# EAGLE design tinybot (EAGLE 7.0.0)
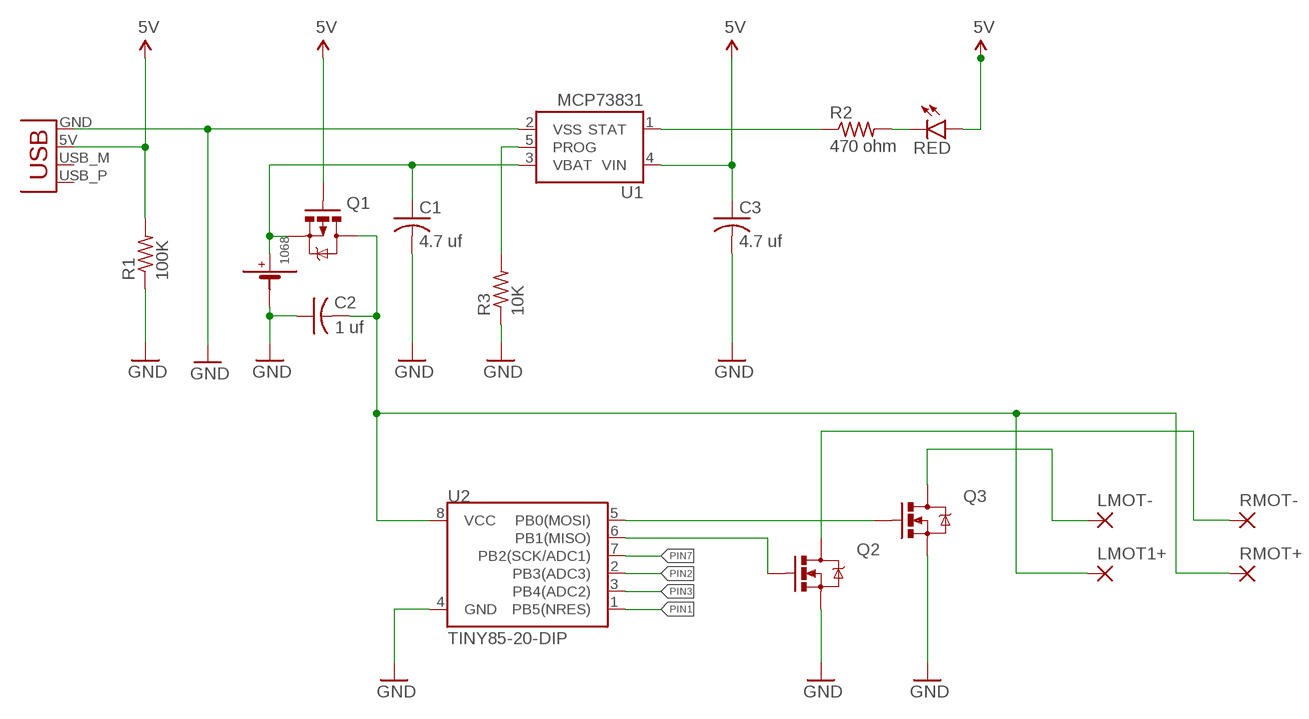
[diagram p0: schematic, sheet 1]

## Parts
C1  4.7 uf  C-US025-025X050  [C025-025X050]
C2  1 uf  C-US025-025X050  [C025-025X050]
C3  4.7 uf  C-US025-025X050  [C025-025X050]
JP1  USBPCB  [USB-A-PCB]
LMOT1+  WIREPADSMD1,27-254  [SMD1,27-2,54]
LMOT-  WIREPADSMD1,27-254  [SMD1,27-2,54]
Q1  MOSFET-PCHANNEL  [SOT23-3]
Q2  2N7002PW  MOSFET-NCHANNELBSS138  [SOT23]
Q3  2N7002PW  MOSFET-NCHANNELBSS138  [SOT23]
R1  100K  R-US_0204/5  [0204/5]
R2  470 ohm  R-US_0204/5  [0204/5]
R3  10K  R-US_0204/5  [0204/5]
RED  LED3MM  [LED3MM]
RMOT+  WIREPADSMD1,27-254  [SMD1,27-2,54]
RMOT-  WIREPADSMD1,27-254  [SMD1,27-2,54]
U1  MCP73831  [SOT23-5]
U2  TINY85-20-DIP  ATTINY45TINY85-20-DIP  [DIP08]
U$1  1068  [KEYSTONE1068]

## Nets
5V: C3.1 JP1.5V(VBUS) Q1.1(G) R1.2 RED.A U1.4(VIN)
GND: C1.2 C2.1 C3.2 JP1.GND Q2.2(S) Q3.2(S) R1.1 R3.1 U1.2(VSS) U2.4(GND) U$1.NEG(-)
N$1: R2.2 RED.K(C)
N$3: R2.1 U1.1(STAT)
N$4: Q3.1(G) U2.5(PB0(MOSI))
N$5: Q2.1(G) U2.6(PB1(MISO))
N$6: LMOT-.1(P) Q3.3(D)
N$8: Q2.3(D) RMOT-.1(P)
N$15: R3.2 U1.5(PROG)
PIN1: U2.1(PB5(NRES))
PIN2: U2.2(PB3(ADC3))
PIN3: U2.3(PB4(ADC2))
PIN7: U2.7(PB2(SCK/ADC1))
VBAT: C1.1 Q1.2(S) U1.3(VBAT) U$1.POS(+)
VCC: C2.2 LMOT1+.1(P) Q1.3(D) RMOT+.1(P) U2.8(VCC)
Unconnected: JP1.USB_M(D-) JP1.USB_P(D+)

## Library data of the parts
C1-C3 = rcl:C-US: CAPACITOR, American symbol
JP1 = SparkFun-Connectors:USB: USB Connectors USB-B-PTH is fully proven SKU : PRT-00139/CONN-08278 USB-miniB is fully proven SKU : PRT-00587 USB-A-PCB is untested. USB-A-H is throughly reviewed, but untested. Spark Fun Electronics SKU : PRT-00437 USB-B-SMT is throughly reviewed, but untested. Needs silkscreen touching up. USB-A-S has not been used/tested USB-MB-H has not been used/tested USB-MICROB has been used. CONN-09505
LMOT1+ LMOT- RMOT+ RMOT- = wirepad:WIREPAD: Wire PAD connect wire on PCB
Q1 = SparkFun-DiscreteSemi:MOSFET-PCHANNEL: Generic PMOSFET IRLML2244 - TRANS-11153 (SOT-23 -20V -4.3A) (1.Gate 2.Source 3.Drain) FQP27P06 - COM-10349 <http://www.sparkfun.com/products/10349> (TO-220 -60V -27A) (1.Gate 2.Source 3.Drain); PROD_ID: TRANS-08285
Q2 Q3 = SparkFun-DiscreteSemi:MOSFET-NCHANNEL: Common NMOSFET Parts MFG P/N Store ID Prod ID FDD8780 TRANS-09984 SI7820DN TRANS-11055 FDS6630A IC-08089 2N7002PW TRANS-11151 FQP30N06L COM-10213 TRANS-10060 BSS123LT1G TRANS-08345 BSS138 TRANS-00830 BS170 2N7000; PROD_ID: TRANS-00830
R1-R3 = rcl:R-US_: RESISTOR, American symbol
RED = SparkFun-LED:LED: LEDs Standard schematic elements and footprints for 5mm, 3mm, 1206, and 0603 sized LEDs. 5mm - Spark Fun Electronics SKU : COM-00529 (and others)
U1 = SparkFun-PowerIC:MCP73831: Miniature single cell, fully integrated Li-Ion, Li-polymer charge management controller http://ww1.microchip.com/downloads/en/DeviceDoc/21984a.pdf IC-09995; PROD_ID: IC-09995
U2 = SparkFun-DigitalIC:ATTINY45: Atmel 8-pin 2/4/8kB flash uC; PROD_ID: IC-09445
U$1 = keystone:1068

## Board
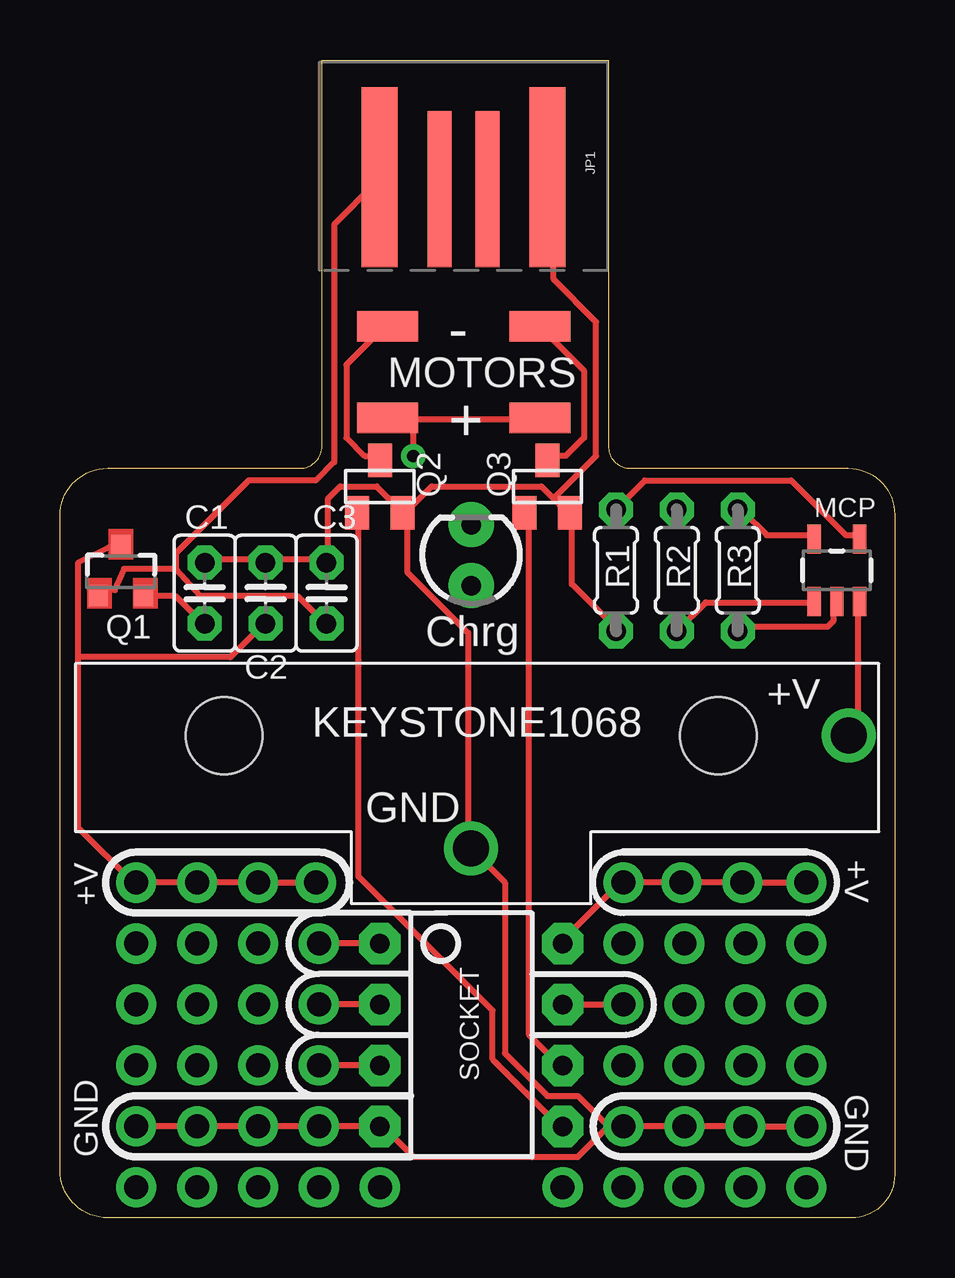
[diagram p1: board, top side]
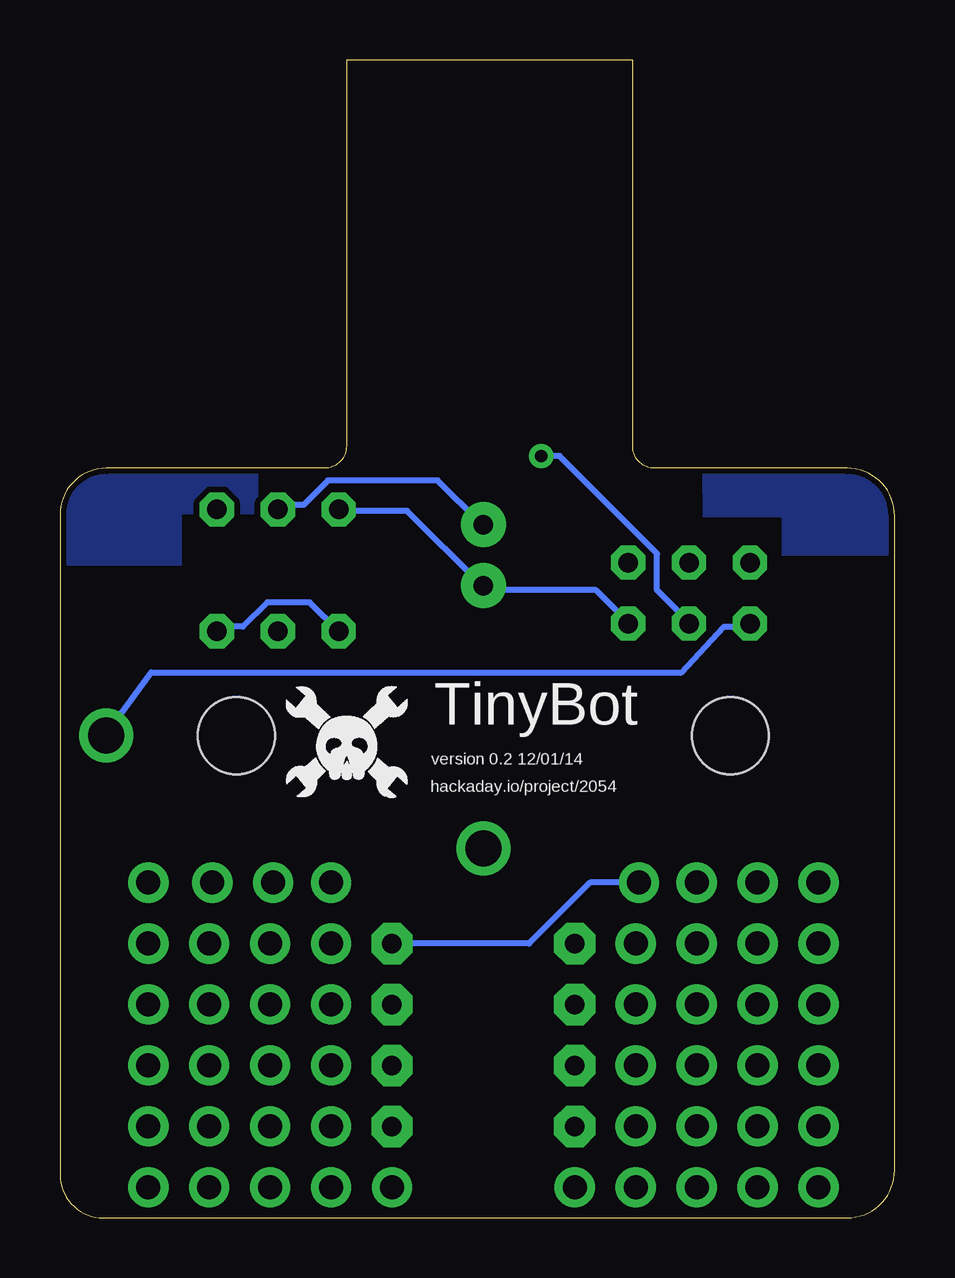
[diagram p2: board, bottom side, seen from below]

Size 34.8 x 48.26 mm. Coordinates in mm from the lower left corner, seen from the top.
Outline: 34.8,29.31 34.8,1.8 arc-90 33,0 1.98,0 arc-90 0,1.98 0,29.26 arc-90 1.98,31.24 10.01,31.24 arc90 10.92,32.16 10.92,48.26 22.86,48.26 22.86,32.16 arc90 23.78,31.24 32.86,31.24 arc-90 34.8,29.31
Copper layers (1*16): Top 0.035mm / dielectric 1.5mm / Bottom 0.035mm
Design rules "SparkFun_10mil": minimum track width 10mil, minimum drill 20mil, track to track 10mil, track to pad 10mil, pad to pad 10mil, via to via 10mil, smd to smd 10mil, copper to edge 10mil, drill to drill 10mil, minimum pad ring 12mil, minimum via ring 10mil, stop-mask expansion 4mil, vias tented up to drill 25mil, thermal gap 10mil
tRestrict: area 11.2,45.7 to 22.7,48.1
bRestrict: area 11,45.7 to 22.6,48.1
Milling: 13 lines

### Footprints (pad centres in the part's own frame; a part is rotated, then mirrored left to right if it is on the bottom)
C025-025X050 = drill 0.813 octagon: 1 -1.27,0; 2 1.27,0
USB-A-PCB = smd 7.5 x 1.5: 5V -0.2,-3.5; GND -0.2,3.5 | smd 6.5 x 1: USB_M 0.3,-1; USB_P 0.3,1
SMD1,27-2,54 = smd 1.27 x 2.54: 1 0,0
SOT23-3 = smd 0.8 x 0.9: 1 -0.95,-1; 2 0.95,-1; 3 0,1.1
SOT23 = smd 1 x 1.4: 1 -0.95,-1.1; 2 0.95,-1.1; 3 0,1.1
0204/5 = drill 0.813 octagon: 1 -2.54,0; 2 2.54,0
LED3MM = drill 0.813 pad 1.88: A -1.27,0; K 1.27,0
SOT23-5 = smd 0.55 x 1.2: 1 -0.95,-1.3; 2 0,-1.3; 3 0.95,-1.3; 4 0.95,1.3; 5 -0.95,1.3
DIP08 = drill 0.813 pad 1.727 octagon: 1 -3.81,-3.81; 2 -1.27,-3.81; 3 1.27,-3.81; 4 3.81,-3.81; 5 3.81,3.81; 6 1.27,3.81; 7 -1.27,3.81; 8 -3.81,3.81
KEYSTONE1068 = drill 1.5: NEG 0,-2.7; POS 15.73,2 | hole 3.2: -10.3,2; 10.3,2

### Placement (x,y rotation side)
C1  6.03,26.04 90 top
C2  8.57,26.04 270 top
C3  11.11,26.04 90 top
JP1  16.83,43.18 270 top
LMOT1+  13.65,33.34 270 top
LMOT-  13.65,37.15 270 top
Q1  2.54,26.92 0 top
Q2  20.32,30.48 0 top
Q3  13.34,30.48 0 top
R1  23.18,26.99 90 top
R2  25.72,26.99 90 top
R3  28.26,26.99 90 top
RED  17.14,27.62 90 top
RMOT+  20,33.34 270 top
RMOT-  20,37.15 270 top
U1  32.38,26.99 0 top
U2  17.14,7.62 270 top
U$1  17.14,18.1 0 top

### Tracks (layer width: path | path; a pad name or v marks a point on that pad's centre or on a via)
5V
  Top 0.254: R1.2 24.38,30.73 30.48,30.73 32.77,28.45 33.27,28.45 U1.4 | 4.83,27.05 2.67,27.05 2.29,26.16 1.78,26.16 Q1.1 | 4.83,27.05 5.84,25.91 9.91,25.91 10.92,24.89 C3.1 | 4.83,27.05 4.83,27.69 7.87,30.73 10.67,30.73 11.43,31.5 11.43,41.4 13.21,43.18 JP1.5V
  Bottom 0.254: C3.1 11.18,24.89 12.45,26.16 17.02,26.16 RED.A 17.27,26.42 20.32,29.46 23.11,29.46 R1.2
GND  (via drill 1 pad 1.68)
  Top 0.254: v23.5,3.81 v26.04,3.81 v28.57,3.81 v31.11,3.81 | v3.17,3.81 v5.71,3.81 v8.26,3.81 v10.79,3.81 U2.4 13.46,3.81 14.73,2.54 21.59,2.54 22.86,3.81 | 22.86,3.81 v23.5,3.81 | U1.2 32.26,25.65 32.26,24.89 32,24.64 28.45,24.64 R3.1 | R1.1 23.11,24.64 21.34,26.42 21.34,29.21 Q2.2 21.08,29.46 20.57,29.97 | C1.2 6.1,27.43 8.38,27.43 C2.1 8.64,27.43 10.92,27.43 C3.2 11.18,27.43 11.18,29.97 11.68,30.48 13.21,30.48 14.22,29.46 Q3.2 | Q3.2 14.48,29.21 14.48,26.92 17.02,24.38 17.02,15.49 U$1.NEG 17.27,15.24 18.54,13.97 18.54,6.86 20.32,5.08 21.59,5.08 22.86,3.81 | 20.57,29.97 20.07,30.48 15.49,30.48 14.48,29.46 Q3.2 | 20.57,29.97 22.35,31.75 22.35,37.34 20.57,39.12 20.57,43.18 JP1.GND | 23.37,3.81 v23.5,3.81
  Bottom 0.254: R1.1 24.38,25.65 26.16,25.65 27.18,24.64 28.19,24.64 R3.1
N$1
  Bottom 0.254: R2.2 25.65,29.72 24.64,29.72 23.62,30.73 19.05,30.73 17.27,28.96 RED.K
N$2  (via drill 1 pad 1.68)
  other vias: 8.26,8.89
N$3
  Top 0.254: R2.1 26.92,25.65 31.24,25.65 U1.1
N$4
  Top 0.254: Q3.1 12.45,29.21 12.45,14.22 18.03,8.64 18.03,6.6 20.83,3.81 U2.5
N$5
  Top 0.254: Q2.1 19.56,29.21 19.56,7.62 20.83,6.35 U2.6
N$6
  Top 0.254: Q3.3 13.21,31.75 12.7,31.75 11.94,32.51 11.94,35.56 13.46,37.08 LMOT-.1
N$8
  Top 0.254: RMOT-.1 21.84,35.31 21.84,32.51 21.08,31.75 20.32,31.75 Q2.3
N$9  (via drill 1 pad 1.68)
  other vias: 31.11,11.43
N$10  (via drill 1 pad 1.68)
  other vias: 3.17,8.89 3.17,8.89
N$13  (via drill 1 pad 1.68)
  other vias: 8.26,1.27 8.26,1.27
N$15
  Top 0.254: U1.5 31.24,28.45 29.46,28.45 28.45,29.46 R3.2
N$16  (via drill 1 pad 1.68)
  other vias: 8.26,11.43
N$17  (via drill 1 pad 1.68)
  other vias: 28.57,8.89
N$18  (via drill 1 pad 1.68)
  other vias: 8.26,6.35
N$20  (via drill 1 pad 1.68)
  other vias: 5.71,11.43
N$21  (via drill 1 pad 1.68)
  other vias: 3.17,6.35
N$22
  pour Bottom (no thermals): 0.08,29.21 0.08,27.61 4.7,27.61 4.7,29.21 8,29.21 8.03,31.19 2.06,31.19 arc90
N$23  (via drill 1 pad 1.68)
  other vias: 5.71,8.89
N$24  (via drill 1 pad 1.68)
  other vias: 3.17,11.43
N$25
  pour Bottom: 33.02,31.11 26.54,31.11 26.54,29.34 29.72,29.34 29.72,27.18 34.65,27.18 34.65,29.08 arc90
N$26  (via drill 1 pad 1.68)
  other vias: 26.04,8.89
N$27  (via drill 1 pad 1.68)
  other vias: 26.04,11.43
N$28  (via drill 1 pad 1.68)
  other vias: 28.57,11.43
N$29  (via drill 1 pad 1.68)
  other vias: 5.71,6.35
N$30  (via drill 1 pad 1.68)
  other vias: 31.11,8.89
N$31  (via drill 1 pad 1.68)
  other vias: 23.5,11.43
N$32  (via drill 1 pad 1.68)
  other vias: 28.57,1.27
N$37  (via drill 1 pad 1.68)
  other vias: 23.5,6.35
N$38  (via drill 1 pad 1.68)
  other vias: 26.04,6.35
N$39  (via drill 1 pad 1.68)
  other vias: 28.57,6.35
N$40  (via drill 1 pad 1.68)
  other vias: 31.11,6.35
N$43  (via drill 1 pad 1.68)
  other vias: 13.34,1.27
N$44  (via drill 1 pad 1.68)
  other vias: 10.79,1.27
N$45  (via drill 1 pad 1.68)
  other vias: 20.95,1.27
N$46  (via drill 1 pad 1.68)
  other vias: 23.5,1.27
N$51  (via drill 1 pad 1.68)
  other vias: 5.71,1.27
N$53  (via drill 1 pad 1.68)
  other vias: 3.17,1.27
N$56  (via drill 1 pad 1.68)
  other vias: 31.11,1.27
N$57  (via drill 1 pad 1.68)
  other vias: 26.04,1.27
PIN1  (via drill 1 pad 1.68)
  Top 0.254: U2.1 v10.79,11.43
PIN2  (via drill 1 pad 1.68)
  Top 0.254: U2.2 v10.79,8.89
PIN3  (via drill 1 pad 1.68)
  Top 0.254: U2.3 v10.79,6.35
PIN7  (via drill 1 pad 1.68)
  Top 0.254: U2.7 v23.5,8.89
VBAT
  Top 0.254: U1.3 33.27,25.65 33.27,20.57 33.02,20.32 U$1.POS | Q1.2 3.56,25.91 4.83,25.91 5.84,24.89 C1.1
  Bottom 0.254: C1.1 6.1,24.64 7.11,24.64 8.89,22.73 30.99,22.73 32.77,20.32 U$1.POS
VCC  (via drill 0.51, 1 pad 1.68)
  Top 0.254: 14.73,33.27 19.81,33.27 RMOT+.1 | 14.73,33.27 13.72,33.27 LMOT1+.1 14.73,33.27 | v14.73,31.75 14.73,33.27 | v31.11,13.97 v28.45,13.97 v25.91,13.97 v23.5,13.97 23.37,13.97 20.83,11.43 U2.8 | v10.67,13.97 v8.26,13.97 v5.71,13.97 v3.17,13.97 3.05,13.97 0.76,16.26 0.76,23.37 | Q1.3 2.54,27.94 2.03,27.94 0.76,27.3 0.76,23.37 | 0.76,23.37 7.11,23.37 8.38,24.64 C2.2
  Bottom 0.254: v14.73,31.75 13.97,31.75 9.91,27.69 9.91,26.16 8.64,24.89 C2.2 | U2.8 15.24,11.43 12.7,13.97 v10.67,13.97
(copper drawn outside any net)
  shapes: Top area x4

### Text on the board
tPlace: - | MOTORS | + | Q2 | Q3 | C1 | C3 | MCP | R1 | R2 | R3 | Q1 | Chrg | C2 | +V | +V | SOCKET | GND | GND
bPlace: TinyBot | version 0.2 12/01/14 | hackaday.io/project/2054